# EAGLE schematic Current (EAGLE 6.2)
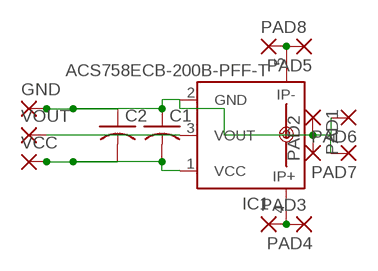
[diagram p0: schematic, sheet 1]

## Parts
C1  C-USC0805K  [C0805K]
C2  C-USC0805K  [C0805K]
GND  SMD2  [SMD1,27-2,54]
IC1  ACS758ECB-200B-PFF-T  [CB-PFF]
PAD1  SMD5  [SMD2,54-5,08]
PAD2  SMD5  [SMD2,54-5,08]
PAD3  SMD5  [SMD2,54-5,08]
PAD4  SMD5  [SMD2,54-5,08]
PAD5  SMD5  [SMD2,54-5,08]
PAD6  SMD5  [SMD2,54-5,08]
PAD7  SMD5  [SMD2,54-5,08]
PAD8  SMD5  [SMD2,54-5,08]
VCC  SMD2  [SMD1,27-2,54]
VOUT  SMD2  [SMD1,27-2,54]

## Nets
5: C1.1 C2.1 GND.1(P) IC1.2(GND) PAD1.1(P) PAD2.1(P) PAD6.1(P) PAD7.1(P)
N$1: IC1.4(IP+) PAD3.1(P) PAD4.1(P)
N$2: IC1.5(IP-) PAD5.1(P) PAD8.1(P)
N$3: C1.2 C2.2 IC1.1(VCC) VCC.1(P)
N$4: IC1.3(VOUT) VOUT.1(P)
Unconnected: IC1.IP+1 IC1.IP-1

## Library data of the parts
C1 C2 = adafruit:C-US: CAPACITOR, American symbol
GND VCC VOUT = wirepad:SMD2: SMD PAD
IC1 = allegro:ACS758*: Thermally Enhanced, Fully Integrated, Hall Effect-Based Linear Current Sensor with 100 micro Ohm Current Conductor display layer 49 Reference in BRD and place VIAs on circles Source: http://www.allegromicro.com/en/Products/Part_Numbers/0758/0758.pdf; MPN: ACS758ECB-200B-PFF-T; OC_FARNELL: 1718993; OC_NEWARK: 04R7127
PAD1-PAD8 = wirepad:SMD5: SMD PAD